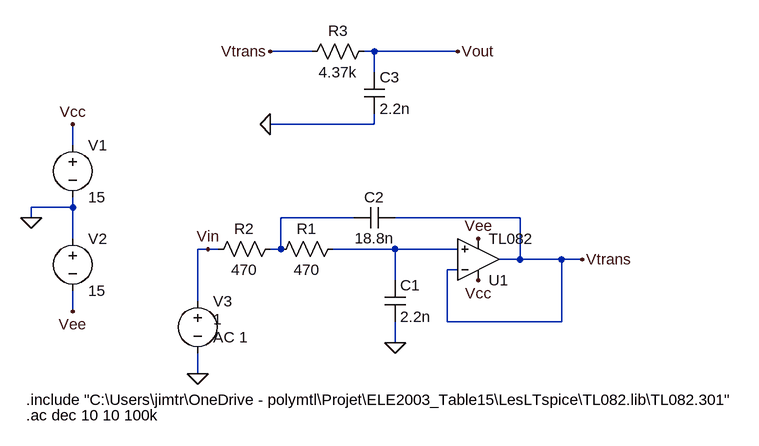
[diagram p0: schematic passe-bas_adapte.asc]
passe-bas_adapte.asc, the LTspice schematic file:
Version 4.1
SHEET 1 1008 680
WIRE 192 -112 128 -112
WIRE 288 -112 272 -112
WIRE 416 -112 288 -112
WIRE 288 -80 288 -112
WIRE 288 0 288 -16
WIRE 288 0 128 0
WIRE -176 32 -176 0
WIRE -176 128 -176 112
WIRE -176 128 -240 128
WIRE -240 144 -240 128
WIRE 256 144 144 144
WIRE 512 144 320 144
WIRE -176 176 -176 128
WIRE 32 192 16 192
WIRE 48 192 32 192
WIRE 144 192 144 144
WIRE 144 192 128 192
WIRE 320 192 224 192
WIRE 416 192 320 192
WIRE 512 208 512 144
WIRE 512 208 480 208
WIRE 576 208 512 208
WIRE 608 208 576 208
WIRE 416 224 400 224
WIRE 320 240 320 192
WIRE 16 272 16 192
WIRE -176 288 -176 256
WIRE 400 304 400 224
WIRE 576 304 576 208
WIRE 576 304 400 304
WIRE 320 336 320 304
WIRE 16 384 16 352
FLAG -240 144 0
FLAG -176 0 Vcc
FLAG -176 288 Vee
FLAG 320 336 0
FLAG 608 208 Vtrans
FLAG 32 192 Vin
FLAG 16 384 0
FLAG 128 -112 Vtrans
FLAG 128 0 0
FLAG 416 -112 Vout
FLAG 448 240 Vcc
FLAG 448 176 Vee
SYMBOL OpAmps\\opamp2 448 272 M180
SYMATTR InstName U1
SYMATTR Value TL082
SYMBOL voltage -176 16 R0
WINDOW 123 0 0 Left 0
WINDOW 39 0 0 Left 0
SYMATTR InstName V1
SYMATTR Value 15
SYMBOL voltage -176 160 R0
WINDOW 123 0 0 Left 0
WINDOW 39 0 0 Left 0
SYMATTR InstName V2
SYMATTR Value 15
SYMBOL cap 304 240 R0
SYMATTR InstName C1
SYMATTR Value 2.2n
SYMBOL cap 320 128 R90
WINDOW 0 0 32 VBottom 2
WINDOW 3 32 32 VTop 2
SYMATTR InstName C2
SYMATTR Value 18.8n
SYMBOL res 240 176 R90
WINDOW 0 0 56 VBottom 2
WINDOW 3 32 56 VTop 2
SYMATTR InstName R1
SYMATTR Value 470
SYMBOL res 144 176 R90
WINDOW 0 0 56 VBottom 2
WINDOW 3 32 56 VTop 2
SYMATTR InstName R2
SYMATTR Value 470
SYMBOL voltage 16 256 R0
WINDOW 3 24 44 Left 2
WINDOW 123 24 72 Left 2
WINDOW 39 0 0 Left 0
SYMATTR Value 1
SYMATTR Value2 AC 1
SYMATTR InstName V3
SYMBOL res 288 -128 R90
WINDOW 0 0 56 VBottom 2
WINDOW 3 32 56 VTop 2
SYMATTR InstName R3
SYMATTR Value 4.37k
SYMBOL cap 272 -80 R0
SYMATTR InstName C3
SYMATTR Value 2.2n
TEXT -248 424 Left 2 !.include "C:\\Users\\jimtr\\OneDrive - polymtl\\Projet\\ELE2003_Table15\\LesLTspice\\TL082.lib\\TL082.301"
TEXT -248 448 Left 2 !.ac dec 10 10 100k

The netlist it stands for:
* passe-bas_adapte.asc
X§U1 N002 Vtrans Vcc Vee Vtrans TL082  ; pins In+ In- V+ V- OUT
V1 Vcc 0 15
V2 0 Vee 15
C1 N002 0 2.2n
C2 Vtrans N001 18.8n
R1 N002 N001 470
R2 N001 Vin 470
V3 Vin 0 1 AC 1
R3 Vout Vtrans 4.37k
C3 Vout 0 2.2n
.include "C:\Users\jimtr\OneDrive - polymtl\Projet\ELE2003_Table15\LesLTspice\TL082.lib\TL082.301"
.ac dec 10 10 100k
.backanno
.end